# EAGLE design Main Board - Single v20  (EAGLE 9.7.0)
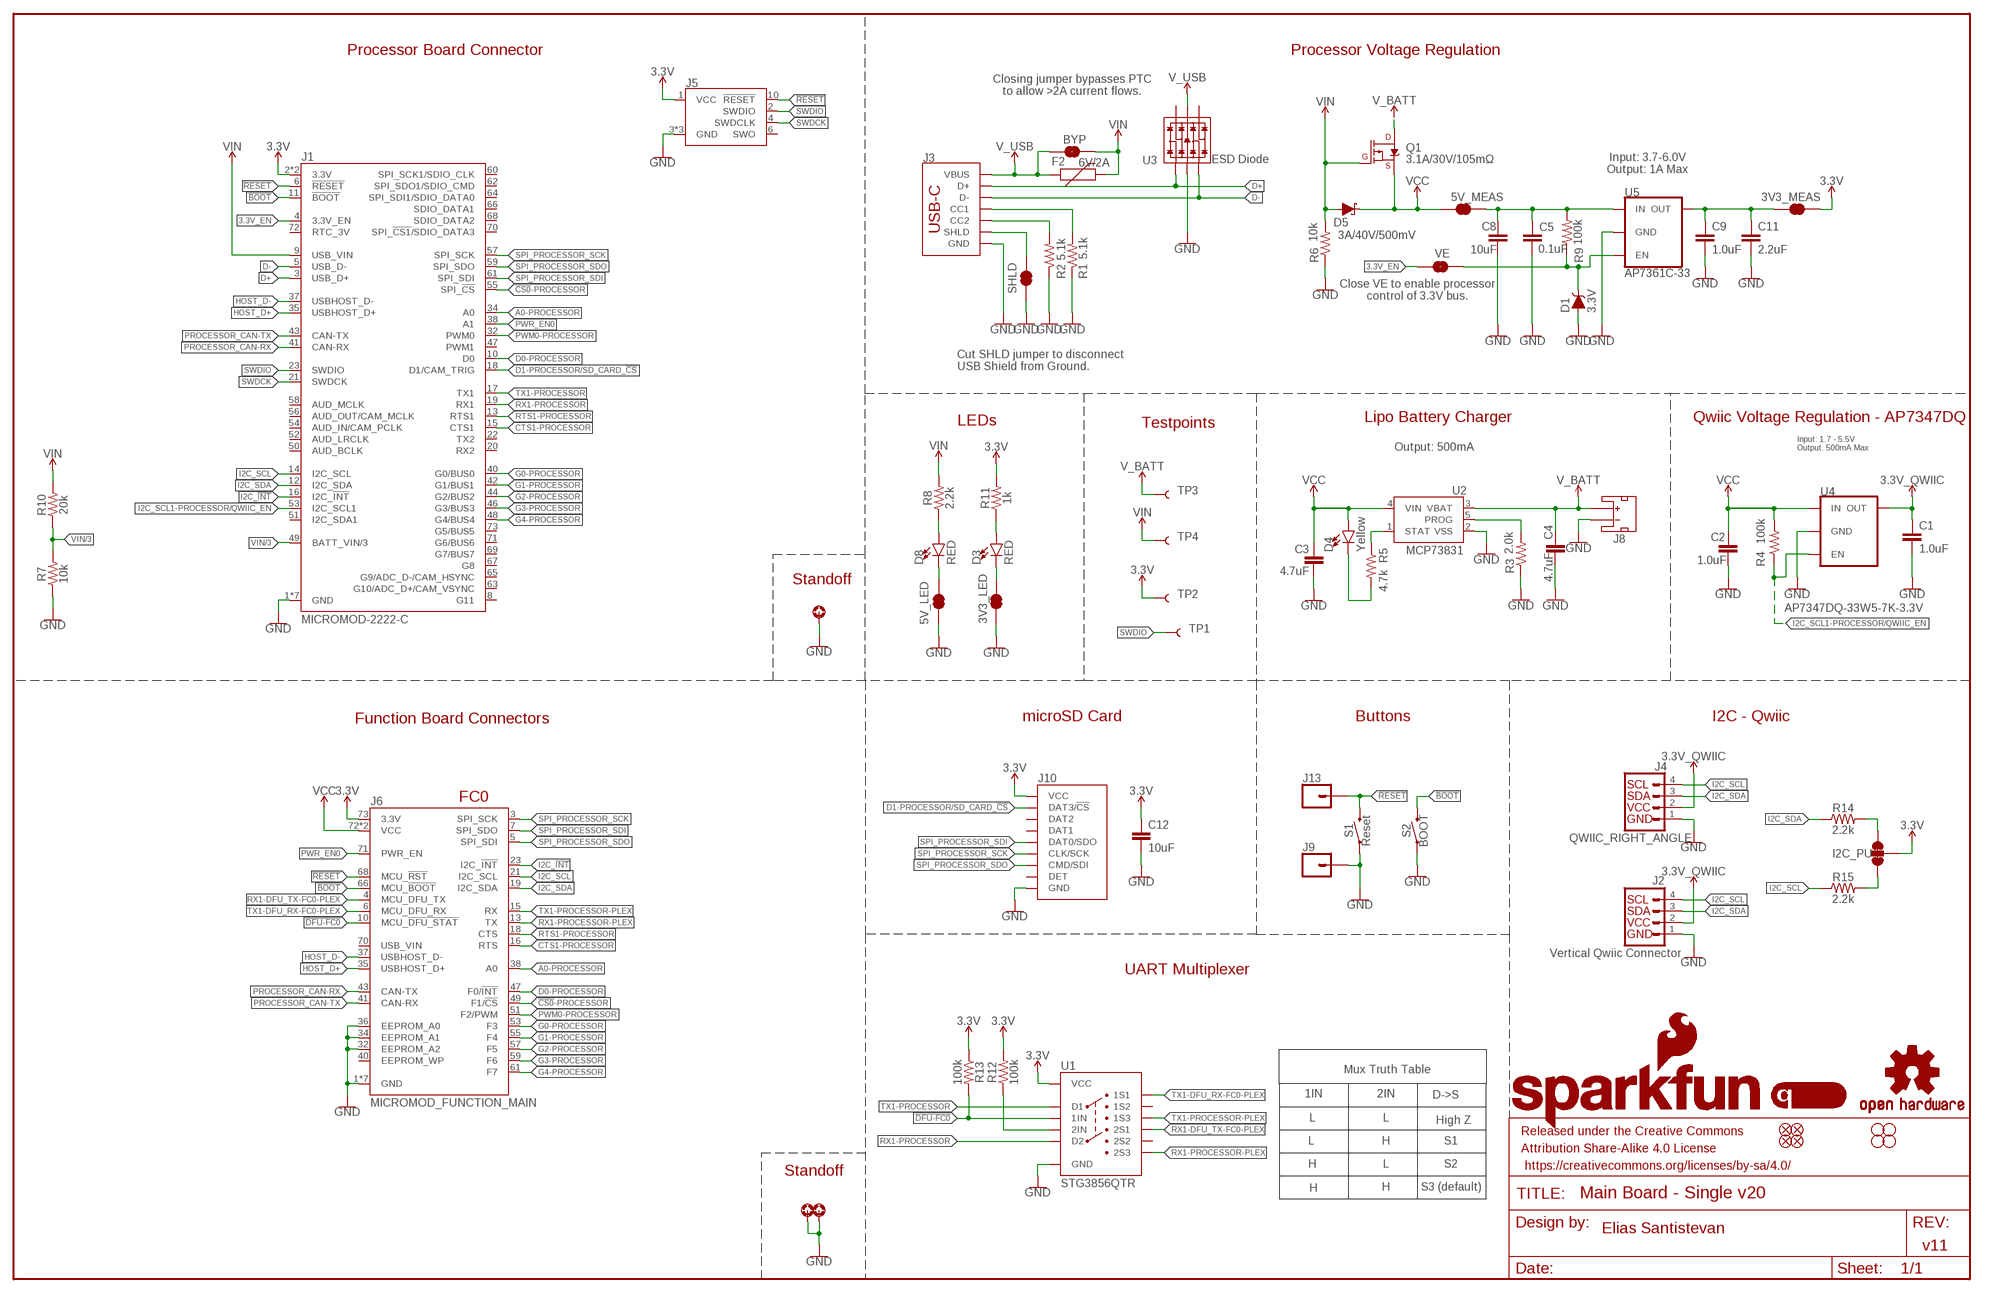
[diagram p0: schematic, sheet 1]

## Parts
3V3_LED  JUMPER-SMT_2_NC_TRACE_SILK  [SMT-JUMPER_2_NC_TRACE_SILK]
3V3_MEAS  JUMPER-COMBO_2_NC_TRACE  [COMBO-JUMPER_2_NC_TRACE]
5V_LED  JUMPER-SMT_2_NC_TRACE_SILK  [SMT-JUMPER_2_NC_TRACE_SILK]
5V_MEAS  JUMPER-COMBO_2_NC_TRACE  [COMBO-JUMPER_2_NC_TRACE]
BYP  JUMPER-SMT_2_NO_SILK  [SMT-JUMPER_2_NO_SILK]
C1  1.0uF  1.0UF-0603-16V-10%  [0603]
C2  1.0uF  1.0UF-0603-16V-10%  [0603]
C3  4.7uF  4.7UF-0603-6.3V-(10%)  [0603]
C4  4.7uF  4.7UF-0603-35V-(20%)  [0603]
C5  0.1uF  0.1UF-0603-25V-(+80/-20%)  [0603]
C8  10uF  10UF-0805-10V-10%  [0805]
C9  1.0uF  1.0UF-0603-16V-10%  [0603]
C11  2.2uF  2.2UF-0603-10V-20%  [0603]
C12  10uF  10UF-0603-6.3V-20%  [0603]
D1  3.3V  DIODE-ZENER-MM3Z3V3T1G  [SOD-323]
D3  RED  LED-RED0603  [LED-0603]
D4  Yellow  LED-YELLOW0603  [LED-0603]
D5  3A/40V/500mV  DIODE-SCHOTTKY-B340A  [SMA-DIODE]
D8  RED  LED-RED0603  [LED-0603]
F2  6V/2A  PPTC_6V2A  [1210]
FD1  FIDUCIAL1X2  [FIDUCIAL-1X2]
FD2  FIDUCIAL1X2  [FIDUCIAL-1X2]
FD3  FIDUCIAL1X2  [FIDUCIAL-1X2]
FD4  FIDUCIAL1X2  [FIDUCIAL-1X2]
FRAME1  FRAME-LEDGER  [CREATIVE_COMMONS]
H2  STAND-OFF-REFLOW-M2.5_2.5MM_TALL  [STAND-OFF-REFLOW-M2.5]
H4  STAND-OFF-REFLOW-M2.5_2.5MM_TALL  [STAND-OFF-REFLOW-M2.5]
H8  STAND-OFF-REFLOW-M2.5_2.5MM_TALL  [STAND-OFF-REFLOW-M2.5]
H14  STAND-OFFTIGHT  [STAND-OFF-TIGHT]
H15  STAND-OFFTIGHT  [STAND-OFF-TIGHT]
H16  STAND-OFFTIGHT  [STAND-OFF-TIGHT]
H17  STAND-OFFTIGHT  [STAND-OFF-TIGHT]
I2C_PU  JUMPER-SMT_3_2-NC_TRACE_SILK  [SMT-JUMPER_3_2-NC_TRACE_SILK]
J1  MICROMOD-2222-C  [M.2-CONNECTOR-E]
J2  Vertical Qwiic Connector  QWIIC_CONNECTOR  [JST04_1MM_VERT]
J3  USB_C_2-LAYER_PADS  [USB-C-16P-2LAYER-PADS]
J4  QWIIC_RIGHT_ANGLE  QWIIC_CONNECTORJS-1MM  [JST04_1MM_RA]
J5  CORTEX_JTAG_DEBUG_MINIMUM_PTH  [2X5-PTH-1.27MM]
J6  MICROMOD_FUNCTION_MAIN  [M.2-CONNECTOR-E-FUNCTION-STANDARD]
J8  JST_2MM_MALE  [JST-2-SMD]
J9  CONN_01PTH_NO_SILK_YES_STOP  [1X01_NO_SILK]
J10  MICRO-SD-PUSH-PUSH-EXT-PIN  [MICROSD-EXTERNALPIN]
J13  CONN_01PTH_NO_SILK_YES_STOP  [1X01_NO_SILK]
LOGO1  QWIIC_LOGO_8MM  [QWIIC_8MM]
LOGO2  SFE_LOGO_NAME_FLAME.3_INCH  [SFE_LOGO_NAME_FLAME_.3]
LOGO3  OSHW-LOGOL  [OSHW-LOGO-L]
Q1  3.1A/30V/105mΩ  MOSFET_PCH-DMG2307L  [SOT23-3]
R1  5.1k  5.1KOHM5.1KOHM-0603-1/10W-1%  [0603]
R2  5.1k  5.1KOHM5.1KOHM-0603-1/10W-1%  [0603]
R3  2.0k  2.0KOHM-0603-1/10W-5%  [0603]
R4  100k  100KOHM-0603-1/10W-1%  [0603]
R5  4.7k  4.7KOHM-0603-1/10W-1%  [0603]
R6  10k  10KOHM-0603-1/10W-1%  [0603]
R7  10k  10KOHM-0603-1/10W-1%  [0603]
R8  2.2k  2.2KOHM-0603-1/10W-1%  [0603]
R9  100k  100KOHM-0603-1/10W-1%  [0603]
R10  20k  20KOHM-0603-1/10W-1%  [0603]
R11  1k  1KOHM-0603-1/10W-1%  [0603]
R12  100k  100KOHM-0603-1/10W-1%  [0603]
R13  100k  100KOHM-0603-1/10W-1%  [0603]
R14  2.2k  2.2KOHM-0603-1/10W-1%  [0603]
R15  2.2k  2.2KOHM-0603-1/10W-1%  [0603]
S1  Reset  MOMENTARY-SWITCH-SPST-SMD-5.2-TALL-REDUNDANT  [TACTILE_SWITCH_SMD_5.2MM]
S2  BOOT  MOMENTARY-SWITCH-SPST-SMD-5.2-TALL-REDUNDANT  [TACTILE_SWITCH_SMD_5.2MM]
SHLD  JUMPER-SMT_2_NC_TRACE_SILK  [SMT-JUMPER_2_NC_TRACE_SILK]
TP1  TEST-POINT3X5  [PAD.03X.05]
TP2  TEST-POINT3X5  [PAD.03X.05]
TP3  TEST-POINT3X5  [PAD.03X.05]
TP4  TEST-POINT3X5  [PAD.03X.05]
U1  STG3856QTR  [STG3856]
U2  MCP73831  [SOT23-5]
U3  ESD Diode  TVS_DIODE_ARRAYSMD  [SOT-23-6]
U4  AP7347DQ-33W5-7K-3.3V  [SOT25]
U5  AP7361C-33  AP7361C-33FGEUDFN-8  [UDFN-8]
VE  JUMPER-SMT_2_NO_SILK  [SMT-JUMPER_2_NO_SILK]

## Nets
3.3V [POWER]: 3V3_MEAS.2 3V3_MEAS.4 C12.1 I2C_PU.2 J1.2(3.3V) J1.74(3.3V) J5.1(VCC) J6.73(3.3V) J10.4(VCC) R11.2 R12.2 R13.1 TP2.1 U1.P11(VCC)
3.3V_EN: J1.4(3.3V_EN) VE.1
3.3V_EN_VE: D1.C R9.1 U5.5(EN) VE.2
3.3V_QWIIC: C1.1 J2.2 J4.2 U4.5(OUT)
!BOOT!: J1.11(!BOOT!) J6.66(MCU_!BOOT!) S2.3 S2.4
!CS0!-PROCESSOR: J1.55(SPI_!CS!) J6.49(F1/!CS!)
!DFU-FC0!: J6.10(MCU_!DFU_STAT!) R13.2 U1.P12(1IN)
!DFU-FC1!: R12.1 U1.P10(2IN)
!RESET!: J1.6(!RESET!) J5.10(!RESET) J6.68(MCU_!RST!) J13.1 S1.3 S1.4
A0-PROCESSOR: J1.34(A0) J6.38(A0)
CTS1-PROCESSOR: J1.15(CTS1) J6.16(RTS)
D0-PROCESSOR: J1.10(D0) J6.47(F0/!INT!)
D1-PROCESSOR/SD_CARD_!CS!: J1.18(D1/CAM_TRIG) J10.2(DAT3/!CS!)
D+ [Diff pairs]: J1.3(USB_D+) J3.A6(D+) J3.B6(D+) U3.1(IO1)
D- [Diff pairs]: J1.5(USB_D-) J3.A7(D-) J3.B7(D-) U3.3(IO2)
G0-PROCESSOR: J1.40(G0/BUS0) J6.53(F3)
G1-PROCESSOR: J1.42(G1/BUS1) J6.55(F4)
G2-PROCESSOR: J1.44(G2/BUS2) J6.57(F5)
G3-PROCESSOR: J1.46(G3/BUS3) J6.59(F6)
G4-PROCESSOR: J1.48(G4/BUS4) J6.61(F7)
GND: 3V3_LED.1 5V_LED.1 C1.2 C2.2 C3.2 C4.2 C5.2 C8.2 C9.2 C11.2 C12.2 D1.A H2.1 H4.1 H8.1 J1.1(GND) J1.7(GND) J1.33(GND) J1.36(GND) J1.39(GND) J1.45(GND) J1.75(GND) J2.1 J3.GND J3.GND2(GND) J4.1 J5.3(GND) J5.5(GND) J5.9(GND) J6.1(GND) J6.2(GND) J6.8(GND) J6.32(EEPROM_A2) J6.33(GND) J6.34(EEPROM_A1) J6.36(EEPROM_A0) J6.39(GND) J6.45(GND) J6.75(GND) J8.1(-) J9.1 J10.6(GND) J10.10(GND) J10.11(GND) J10.12(GND) J10.13(GND) R1.1 R2.1 R3.1 R6.1 R7.1 S1.1 S1.2 S2.1 S2.2 SHLD.1 U1.P5(GND) U2.2(VSS) U3.2(VSS) U4.2(GND) U5.4(GND) U5.EP(GND)
HOST_D+ [Diff pairs]: J1.35(USBHOST_D+) J6.35(USBHOST_D+)
HOST_D- [Diff pairs]: J1.37(USBHOST_D-) J6.37(USBHOST_D-)
I2C_!INT!: J1.16(I2C_!INT!) J6.23(I2C_!INT!)
I2C_SCL: J1.14(I2C_SCL) J2.4 J4.4 J6.21(I2C_SCL) R15.1
I2C_SCL1-PROCESSOR/QWIIC_EN: J1.53(I2C_SCL1) R4.1 U4.3(EN)
I2C_SDA: J1.12(I2C_SDA) J2.3 J4.3 J6.19(I2C_SDA) R14.1
N$1: 3V3_MEAS.1 3V3_MEAS.3 C9.1 C11.1 U5.1(OUT)
N$2: 5V_LED.2 D8.C
N$3: D3.A R11.1
N$4: J3.B5(CC2) R2.2
N$5: J3.A5(CC1) R1.2
N$6: R3.2 U2.5(PROG)
N$10: 3V3_LED.2 D3.C
N$11: I2C_PU.3 R14.2
N$12: D8.A R8.1
N$13: I2C_PU.1 R15.2
N$14: D4.C R5.2
N$15: R5.1 U2.1(STAT)
PROCESSOR_CAN-RX: J1.41(CAN-RX) J6.43(CAN-TX)
PROCESSOR_CAN-TX: J1.43(CAN-TX) J6.41(CAN-RX)
PWM0-PROCESSOR: J1.32(PWM0) J6.51(F2/PWM)
PWR_EN0: J1.38(A1) J6.71(PWR_EN)
RTS1-PROCESSOR: J1.13(RTS1) J6.18(CTS)
RX1-DFU_TX-FC0-PLEX: J6.4(MCU_DFU_TX) U1.P9(2S1)
RX1-PROCESSOR: J1.19(RX1) U1.P6(D2)
RX1-PROCESSOR-PLEX: J6.13(TX) U1.P7(2S3)
SHLD: J3.SHLD1(SHLD) J3.SHLD2(SHLD) J3.SHLD3(SHLD) J3.SHLD4(SHLD) SHLD.2
SPI_PROCESSOR_SCK: J1.57(SPI_SCK) J6.3(SPI_SCK) J10.5(CLK/SCK)
SPI_PROCESSOR_SDI: J1.61(SPI_SDI) J6.7(SPI_SDO) J10.7(DAT0/SDO)
SPI_PROCESSOR_SDO: J1.59(SPI_SDO) J6.5(SPI_SDI) J10.3(CMD/SDI)
SWDCK: J1.21(SWDCK) J5.4(SWDCLK)
SWDIO: J1.23(SWDIO) J5.2(SWDIO) TP1.1
TX1-DFU_RX-FC0-PLEX: J6.6(MCU_DFU_RX) U1.P1(1S1)
TX1-PROCESSOR: J1.17(TX1) U1.P4(D1)
TX1-PROCESSOR-PLEX: J6.15(RX) U1.P3(1S3)
V_BATT [POWER]: C4.1 J8.2(+) Q1.3(D) TP3.1 U2.3(VBAT)
V_USB: BYP.1 F2.1 J3.VBUS1(VBUS) J3.VBUS2(VBUS) U3.5(VCC)
VCC: 5V_MEAS.1 5V_MEAS.3 C2.1 C3.1 D4.A D5.C J6.72(VCC) J6.74(VCC) Q1.2(S) R4.2 U2.4(VIN) U4.1(IN)
VCC_MEAS: 5V_MEAS.2 5V_MEAS.4 C5.1 C8.1 R9.2 U5.8(IN)
VIN: BYP.2 D5.A F2.2 J1.9(USB_VIN) Q1.1(G) R6.2 R8.2 R10.2 TP4.1
VIN/3: J1.49(BATT_VIN/3) R7.2 R10.1
Unconnected: J1.8(G11) J1.20(RX2) J1.22(TX2) J1.47(PWM1) J1.50(AUD_BCLK) J1.51(I2C_SDA1) J1.52(AUD_LRCLK) J1.54(AUD_IN/CAM_PCLK) J1.56(AUD_OUT/CAM_MCLK) J1.58(AUD_MCLK) J1.60(SPI_SCK1/SDIO_CLK) J1.62(SPI_SDO1/SDIO_CMD) J1.63(G10/ADC_D+/CAM_VSYNC) J1.64(SPI_SDI1/SDIO_DATA0) J1.65(G9/ADC_D-/CAM_HSYNC) J1.66(SDIO_DATA1) J1.67(G8) J1.68(SDIO_DATA2) J1.69(G7/BUS7) J1.70(SPI_!CS1!/SDIO_DATA3) J1.71(G6/BUS6) J1.72(RTC_3V) J1.73(G5/BUS5) J5.6(SWO) J6.40(EEPROM_WP) J6.70(USB_VIN) J8.NC1(PAD1) J8.NC2(PAD2) J10.1(DAT2) J10.8(DAT1) J10.9(DET) U1.P2(1S2) U1.P8(2S2) U3.4(IO3) U3.6(IO4)

## Notes on the sheet
- Processor Board Connector | Processor Voltage Regulation
- Closing jumper bypasses PTC
  to allow >2A current flows.
- Input: 3.7-6.0V
  Output: 1A Max
- Close VE to enable processor
  control of 3.3V bus.
- Cut SHLD jumper to disconnect
  USB Shield from Ground.
- Lipo Battery Charger | Qwiic Voltage Regulation - AP7347DQ
- LEDs | Testpoints
- Output: 500mA
- Input: 1.7 - 5.5V
  Output: 500mA Max
- Standoff
- Function Board Connectors | microSD Card | Buttons | I2C - Qwiic
- FC0
- UART Multiplexer
- Mux Truth Table
- 1IN | 2IN | D->S
- L | L | High Z
- L | H | S1
- H | L | S2
- Standoff
- H | H | S3 (default)
- Elias Santistevan
- v11

## Library data of the parts
3V3_LED 5V_LED SHLD = SparkFun-Jumpers:JUMPER-SMT_2_NC_TRACE: Normally closed trace jumper This jumper has a trace between two pads so it's normally closed (NC). Use a razor knife to open the connection. For best results follow the IPC guidelines for cutting traces: Cutout at least 0.063 mm (0.005 in). Remove all loose material to clean up the cut area. Seal the cut with an approved epoxy. Reapply solder to reclose the connection.
3V3_MEAS 5V_MEAS = SparkFun-Jumpers:JUMPER-COMBO_2_NC_TRACE
BYP VE = SparkFun-Jumpers:JUMPER-SMT_2_NO: Normally open jumper This jumper has two pads in close proximity to each other. Apply solder to close the connection. Round pads are easier to solder for beginners, but are a lot larger. SparkFun Product that uses the round pads: SparkFun EL Sequencer <https://www.sparkfun.com/products/12781>
C1 C2 C9 = SparkFun-Capacitors:1.0UF: 1µF ceramic capacitors A capacitor is a passive two-terminal electrical component used to store electrical energy temporarily in an electric field.; PROD_ID: CAP-00868
C3 = SparkFun-Capacitors:4.7UF: 4.7µF ceramic capacitors A capacitor is a passive two-terminal electrical component used to store electrical energy temporarily in an electric field.; PROD_ID: CAP-08280
C4 = SparkFun-Capacitors:4.7UF: 4.7µF ceramic capacitors A capacitor is a passive two-terminal electrical component used to store electrical energy temporarily in an electric field.; PROD_ID: CAP-14106
C5 = SparkFun-Capacitors:0.1UF: 0.1µF ceramic capacitors A capacitor is a passive two-terminal electrical component used to store electrical energy temporarily in an electric field.; PROD_ID: CAP-00810
C8 = SparkFun-Capacitors:10UF: 10.0µF ceramic capacitors A capacitor is a passive two-terminal electrical component used to store electrical energy temporarily in an electric field.; PROD_ID: CAP-11330
C11 = SparkFun-Capacitors:2.2UF: 2.2µF ceramic capacitors A capacitor is a passive two-terminal electrical component used to store electrical energy temporarily in an electric field.; PROD_ID: CAP-07888
C12 = SparkFun-Capacitors:10UF: 10.0µF ceramic capacitors A capacitor is a passive two-terminal electrical component used to store electrical energy temporarily in an electric field.; PROD_ID: CAP-11015
D1 = SparkFun-DiscreteSemi:DIODE-ZENER: Zener Diode A Zener diode allows current to flow from its anode to its cathode like a normal semiconductor diode, but it also permits current to flow in the reverse direction when its "Zener voltage" is reached. - WIkipedia; PROD_ID: DIO-11284
D3 D8 = SparkFun-LED:LED-RED: Red SMD LED Used in manufacturing of most products at SparkFun Packages: 0603 - SMD 0603 package [Product Link] <http://docs.avagotech.com/docs/AV02-0551EN> 0603 SMART - SMD 0603 SMART package ( more efficient and expensive)[Product Link] <http://www.osram-os.com/Graphics/XPic2/00077099_0.pdf> 1206 - SMD1206 package [Product Link] <https://www.sparkfun.com/datasheets/DevTools/LilyPad/Q150OVS4.pdff> SparkFun Products: Pro Mini 328 -5V <https://www.sparkfun.com/products/821> RedBoard <https://www.sparkfun.com/products/12757> IOIO-OTG <https://www.sparkfun.com/products/13613>; PROD_ID: DIO-00819
D4 = SparkFun-LED:LED-YELLOW: Yellow SMD LED Used in manufacturing several products at SparkFun. Packages: 0603 - SMD 0603 package[Product Link] <http://www.kingbrightusa.com/product.asp?catalog_name=LED&product_id=APT1608SYCK> 0603 -SMART - SMART SMD 0603 package (more efficient/more expensive) [Product Link] <http://www.osram-os.com/osram_os/en/products/product-catalog/led-light-emitting-diodes/smartled-0603/ly-l29k/index.jsp> LilyPad - SMD1206 package[Product Datasheet] <https://www.sparkfun.com/datasheets/DevTools/LilyPad/Q150YUS4.pdf> SparkFun Products: Blynk Board <https://www.sparkfun.com/products/13794> IOIO-OTG <https://www.sparkfun.com/products/13613> XBee Explorer Serial <https://www.sparkfun.com/products/13225>; PROD_ID: DIO-09003
D5 = SparkFun-DiscreteSemi:DIODE-SCHOTTKY: Schottky diode A Schottky diode is a semiconductor diode which has a low forward voltage drop and a very fast switching action.; PROD_ID: DIO-09886
F2 = SparkFun-Fuses:PPTC: Resettable Fuse PPTC Resettable Fuse. Really a sort of resistor with a polymeric positive temperature coefficient whose resistance increases dramatically with an increase in temperature. When heated by the power passing through the resistance rises causing the current to be limited, protecting the circuit. This is achieved by the transition of the polymer from a crystalline to an amorphous state where the conductive carbon separates breaking the conductive pathways found in the cool crystalline structure. When a PPTC cools back down it resumes conducting letting the circuit turn back on. SparkFun Products: SparkFun RedBoard - Programmed with Arduino <https://www.sparkfun.com/products/12757> Pro Micro - 5V/16MHz <https://www.sparkfun.com/products/12640> Arduino Pro 328 - 5V/16MHz <https://www.sparkfun.com/products/10915> MP3 Trigger <https://www.sparkfun.com/products/13720>; PROD_ID: RES-14313
FD1-FD4 = SparkFun-Aesthetics:FIDUCIAL: Fiducial Alignment Points Point-of-reference for pick-and-place machines and other optical instruments.
FRAME1 = SparkFun-Aesthetics:FRAME-LEDGER: Schematic Frame - Ledger Standard 11x14 US Ledger frame
H2 H4 H8 = SparkFun-Hardware:STAND-OFF-REFLOW: Stand Off Reflow Compatible A metal standoff that can be placed and reflowed onto a PCB. The M2.5 x 2.5mm variant is used on MicroMod. The M2.5 x 1.5mm variant is used to hold mPCIe boards, including the Swarm M138. The M2.0 x 6.0mm variant is used to mount the Iridium 9603N modem.; PROD_ID: HW-14899
H14-H17 = SparkFun-Hardware:STAND-OFF: Stand Off Drill holes for mechanically mounting via screws, standoffs, etc. Note: Use the keepout ring to avoid running the screw head into surrounding components. Variant Overviews STAND-OFF - Mechanical footprint for a #4 phillips button head screw. STAND-OFF-TIGHT - Mechanical footprint for a #4 phillips button head screw, Example SparkFun Products Screw - Phillips Head (1/4", 4-40, 10 pack) <https://www.sparkfun.com/products/10453> (PRT-10453) Screw - Phillips Head (1/2", 4-40, 10 pack) <https://www.sparkfun.com/products/10452> (PRT-10452) Screw - Phillips Head (3/4", 4-40, 10 pack) <https://www.sparkfun.com/products/10451> (PRT-10451) Screw - Phillips Head (1", 4-40, 10 pack) <https://www.sparkfun.com/products/10450> (PRT-10450)
I2C_PU = SparkFun-Jumpers:JUMPER-SMT_3_2-NC_TRACE: Normally closed trace jumper (2 of 2 connections) This jumper has a trace between all three pads so they are normally closed (NC). Use a razor knife to open the connection(s). For best results follow the IPC guidelines for cutting traces: Cutout at least 0.063 mm (0.005 in). Remove all loose material to clean up the cut area. Seal the cut with an approved epoxy. Reapply solder to reclose the connection(s).
J1 = SparkFun-MicroMod:MICROMOD: MicroMod Connector Description: A card edge connector and mating PCB connector to allow various MicroMod Processor Boards to be coupled with various carrier boards of different capabilities. Based on the M.2 standard.; PROD_ID: CONN-14877
J2 = SparkFun-Connectors:QWIIC_CONNECTOR: SparkFun I2C Standard Qwiic Connector An SMD 1mm pitch JST connector makes it easy and quick (get it? Qwiic?) to connect I2C devices to each other. The Qwiic system <http://www.sparkfun.com/qwiic> enables fast and solderless connection between popular platforms and various sensors and actuators. We carry 200mm <https://www.sparkfun.com/products/14204>, 100mm <https://www.sparkfun.com/products/14205>, 50mm <https://www.sparkfun.com/products/14206>, and breadboard friendly <https://www.sparkfun.com/products/14207> Qwiic cables. We also offer 10 pcs strips <https://www.sparkfun.com/products/14323> the SMD connectors.; PROD_ID: CONN-14483
J3 = SparkFun-Connectors:USB_C: USB Type C 16Pin Connector Super Speed pins not available on the 16-pin purely SMD connector so this part is best for USB 2.0 implementations. D1 and D2 are tied together enabling D+/- no matter which way the cable is plugged into the connector. The two channel configuration pins (CC1/2) are exposed. These are normally connected to ground via 5.1k resistors but can be reconfigured for high current/high power applications. **4-LAYER BOARD WARNING!!** If designing 4-layer board, make sure to select the variant _4-LAYER-ISOLATED. The linked footprint (USB-C-16-4LAYER-ISOLATED) includes some very necessary cutout polygons in the inner layers (2 and 15). This prevents the PTH mounting shield legs on the USB connector from electrically connecting any other polygons on the inner layers (usually VCC and GND).; PROD_ID: CONN-14122
J4 = SparkFun-Connectors:QWIIC_CONNECTOR: SparkFun I2C Standard Qwiic Connector An SMD 1mm pitch JST connector makes it easy and quick (get it? Qwiic?) to connect I2C devices to each other. The Qwiic system <http://www.sparkfun.com/qwiic> enables fast and solderless connection between popular platforms and various sensors and actuators. We carry 200mm <https://www.sparkfun.com/products/14204>, 100mm <https://www.sparkfun.com/products/14205>, 50mm <https://www.sparkfun.com/products/14206>, and breadboard friendly <https://www.sparkfun.com/products/14207> Qwiic cables. We also offer 10 pcs strips <https://www.sparkfun.com/products/14323> the SMD connectors.; PROD_ID: CONN-13694
J5 = SparkFun-Connectors:CORTEX_JTAG_DEBUG_MINIMUM: Cortex Debug Connector - 10 pin Supports JTAG debug, Serial Wire debug, and Serial Wire Viewer. PTH and SMD connector options available. General Connector Information <http://infocenter.arm.com/help/topic/com.arm.doc.faqs/attached/13634/cortex_debug_connectors.pdf> Products: PTH Connector <http://www.digikey.com/product-detail/en/cnc-tech/3220-10-0100-00/1175-1627-ND/3883661> -via Digi-Key SparkFun PSoc <https://www.sparkfun.com/products/13229> SparkFun T <https://www.sparkfun.com/products/13810>
J6 = SparkFun-MicroMod:MICROMOD_FUNCTION: MicroMod Connector Description: A card edge connector and mating PCB connector to allow various MicroMod Processor Boards to be coupled with various carrier boards of different capabilities. Based on the M.2 standard.; PROD_ID: CONN-14877
J8 = SparkFun-Connectors:JST_2MM_MALE: JST 2MM MALE RA CONNECTOR Two pin, compact surface mount connector. Commonly used as a battery input connection point. We really like the solid locking feeling and high current rating on these small connectors. We use these all the time as battery connectors. Mates to single-cell LiPo batteries. Here is the connector we sell at SparkFun: JST Right Angle Connector - White <https://www.sparkfun.com/products/8612> (PRT-08612) Datasheet <http://www.sparkfun.com/datasheets/Prototyping/Connectors/JST-Horizontal.pdf> It was used on these SparkFun products: SparkFun MOSFET Power Controller <https://www.sparkfun.com/products/11214> (PRT-11214) SparkFun Battery Babysitter - LiPo Battery Manager <https://www.sparkfun.com/products/13777> (PRT-13777) And many, many others that required a lipo battery connection.; PROD_ID: CONN-11443; SF_ID: PRT-08612
J9 J13 = SparkFun-Connectors:CONN_01: Single connection point. Often used as Generic Header-pin footprint for 0.1 inch spaced/style header connections On any of the 0.1 inch spaced packages, you can populate with these: Break Away Headers - Straight <https://www.sparkfun.com/products/116> (PRT-00116) Break Away Male Headers - Right Angle <https://www.sparkfun.com/products/553> (PRT-00553) Female Headers <https://www.sparkfun.com/products/115> (PRT-00115) Break Away Headers - Machine Pin <https://www.sparkfun.com/products/117> (PRT-00117) Break Away Female Headers - Swiss Machine Pin <https://www.sparkfun.com/products/743> (PRT-00743) This device is also useful as a general connection point to wire up your design to another part of your project. Our various solder wires solder well into these plated through hole pads. Hook-Up Wire - Assortment (Stranded, 22 AWG) <https://www.sparkfun.com/products/11375> (PRT-11375) Hook-Up Wire - Assortment (Solid Core, 22 AWG) <https://www.sparkfun.com/products/11367> (PRT-11367) View the entire wire category on our website here <https://www.sparkfun.com/categories/141> Special notes: SMTSO-256-ET is a "flush mount" nut for a 4-40 screw. We mostly use this on specialty testbeds; it is a nice way to connect hardware to your PCB at an adjustable hieght. Also note, the SNAP packages are for using a snappable style connector. We sell a baggie of snaps and they are also used on two LilyPad designs: Snap Assortment - 30 pack (male and female) <https://www.sparkfun.com/products/11347> (DEV-11347) LilyPad Arduino SimpleSnap <https://www.sparkfun.com/products/10941> (DEV-10941) LilyPad SimpleSnap Protoboard <https://www.sparkfun.com/products/10940> (DEV-10940)
J10 = SparkFun-Connectors:MICRO-SD: microSD Socket for Transflash Various sockets for µSD. tDoc lines correctly indicate media card edge positions when inserting (unlocked, locked, depressed). NOTE: CD1 and CD2 are connected internally, and the default detect state of the socket is detect pin to ground. SparkFun Products: WAV Trigger <https://www.sparkfun.com/products/13660> CAN-Bus Shield <https://www.sparkfun.com/products/13262> SparkFun Level Shifing microSD Breakout <https://www.sparkfun.com/products/13743>; PROD_ID: CONN-16110
LOGO1 = SparkFun-Aesthetics:QWIIC_LOGO: Qwiic Logos for placement on schematic and PCB. The 5.5mm silk logo is best for placing next to Qwiic connector.
LOGO2 = SparkFun-Aesthetics:SFE_LOGO_NAME_FLAME: SparkFun Font Logo w/ Flame This is the SparkFun full logo. The logo on the schematic will always be the same size; the package variant is the height of the flame part of the logo. Default layer for the logo on the board is tSilk.
LOGO3 = SparkFun-Aesthetics:OSHW-LOGO: Open-Source Hardware (OSHW) Logo This logo indicates the piece of hardware it is found on incorporates a OSHW license and/or adheres to the definition of open source hardware found here: http://freedomdefined.org/OSHW
Q1 = SparkFun-DiscreteSemi:MOSFET_PCH: P-channel MOSFETs Voltage controlled devices that allow control of high current outputs. SparkFun Products: SparkFun ESP32 Thing <https://www.sparkfun.com/products/13907> SparkFun ESP8266 Thing <https://www.sparkfun.com/products/13231> SparkFun Pi Servo HAT V2 <https://www.sparkfun.com/products/15316> DMG2305UX-7 (20V/4.2A/SOT23-3); PROD_ID: TRANS-11308
R1 R2 = SparkFun-Resistors:5.1KOHM; PROD_ID: RES-12083
R3 = SparkFun-Resistors:2.0KOHM: 2kΩ resistor A resistor is a passive two-terminal electrical component that implements electrical resistance as a circuit element. Resistors act to reduce current flow, and, at the same time, act to lower voltage levels within circuits. - Wikipedia; PROD_ID: RES-08296
R4 R9 R12 R13 = SparkFun-Resistors:100KOHM: 100kΩ resistor A resistor is a passive two-terminal electrical component that implements electrical resistance as a circuit element. Resistors act to reduce current flow, and, at the same time, act to lower voltage levels within circuits. - Wikipedia; PROD_ID: RES-07828
R5 = SparkFun-Resistors:4.7KOHM: 4.7kΩ resistor A resistor is a passive two-terminal electrical component that implements electrical resistance as a circuit element. Resistors act to reduce current flow, and, at the same time, act to lower voltage levels within circuits. - Wikipedia; PROD_ID: RES-07857
R6 R7 = SparkFun-Resistors:10KOHM: 10kΩ resistor A resistor is a passive two-terminal electrical component that implements electrical resistance as a circuit element. Resistors act to reduce current flow, and, at the same time, act to lower voltage levels within circuits. - Wikipedia; PROD_ID: RES-00824
R8 R14 R15 = SparkFun-Resistors:2.2KOHM: 2.2kΩ resistor A resistor is a passive two-terminal electrical component that implements electrical resistance as a circuit element. Resistors act to reduce current flow, and, at the same time, act to lower voltage levels within circuits. - Wikipedia; PROD_ID: RES-08272
R10 = SparkFun-Resistors:20KOHM: 20kΩ resistor A resistor is a passive two-terminal electrical component that implements electrical resistance as a circuit element. Resistors act to reduce current flow, and, at the same time, act to lower voltage levels within circuits. - Wikipedia; PROD_ID: RES-09383
R11 = SparkFun-Resistors:1KOHM: 1kΩ resistor A resistor is a passive two-terminal electrical component that implements electrical resistance as a circuit element. Resistors act to reduce current flow, and, at the same time, act to lower voltage levels within circuits. - Wikipedia; PROD_ID: RES-07856
S1 S2 = SparkFun-Switches:MOMENTARY-SWITCH-SPST: Momentary Switch (Pushbutton) - SPST Normally-open (NO) SPST momentary switches (buttons, pushbuttons). Variants PTH-12MM - 12mm square, through-hole Momentary Pushbutton Switch - 12mm Square <https://www.sparkfun.com/products/9190> (COM-09190) PTH-6.0MM, PTH-6.0MM-KIT - 6.0mm square, through-hole Mini Pushbutton Switch <https://www.sparkfun.com/products/97> (COM-00097) KIT package intended for soldering kit's - only one side of pads' copper is exposed. PTH-RIGHT-ANGLE-KIT - Right-angle, through-hole Right Angle Tactile Button <https://www.sparkfun.com/products/10791> - Used on SparkFun BigTime Watch Kit <https://www.sparkfun.com/products/11734> SMD-12MM - 12mm square, surface-mount Tactile Button - SMD (12mm) <https://www.sparkfun.com/products/12993> (COM-12993) Used on SparkFun PicoBoard <https://www.sparkfun.com/products/11888> SMD-4.5MM - 4.5mm Square Trackball Switch Used on SparkFun Blackberry Trackballer Breakout <https://www.sparkfun.com/products/13169> SMD-4.6MMX2.8MM - 4.60mm x 2.80mm, surface mount Used on SparkFun Pro Micro - RP2040 <https://www.sparkfun.com/products/17717> SMD-5.2MM, SMD-5.2-REDUNDANT - 5.2mm square, surface-mount Mini Pushbutton Switch - SMD <https://www.sparkfun.com/products/8720> (COM-08720) Used on Arduino Pro Mini <https://www.sparkfun.com/products/11114> REDUNDANT package connects both switch circuits together SMD-6.0X3.5MM - 6.0 x 3.5mm, surface mount Momentary Reset Switch SMD <https://www.sparkfun.com/products/8229> (COM-08229) SMD-6.2MM-TALL - 6.2mm square, surface mount Tactile Button - SMD (6mm) <https://www.sparkfun.com/products/12992> Used on SparkFun Digital Sandbox <https://www.sparkfun.com/products/12651> SMD-RIGHT-ANGLE - Right-angle, surface mount Used on SparkFun Block for Intel® Edison - Arduino <https://www.sparkfun.com/products/13036>; PROD_ID: SWCH-14139
TP1-TP4 = SparkFun-Connectors:TEST-POINT: SparkFun Test Points Bare copper test points for troubleshooting or In-Circuit-Testing. These are used by our Production team for verifying production board runs using pogo-pins on test beds. SparkFun Products: SparkFun LSM9DS1 Breakout <https://www.sparkfun.com/products/13284> SparkFun PSOC <https://www.sparkfun.com/products/13714> SparkFun Load Cell Amplifier <https://www.sparkfun.com/products/13879>
U1 = dip_switch:STG3856QTR
U2 = SparkFun-IC-Power:MCP73831: MCP73831T Li-Ion, Li-Pol Controller Miniature single cell, fully integrated Li-Ion, Li-polymer charge management controller Datasheet <http://ww1.microchip.com/downloads/en/DeviceDoc/20001984g.pdf> SparkFun Products: SparkFun ESP32 Thing <https://www.sparkfun.com/products/13907> SparkFun 9DoF Razor IMU M0 <https://www.sparkfun.com/products/14001>; PROD_ID: IC-09995
U3 = SparkFun-DiscreteSemi:TVS_DIODE_ARRAY; PROD_ID: IC-13538
U4 = dip_switch:AP7347DQ-33W5-7: AP7347DQ - 500mA CMOS LDO Regulator w/ Enable The AP2112 is CMOS process low dropout linear regulator with enable function, the regulator delivers a guaranteed 600mA (min.) continuous load current. Features Output Voltage Accuracy: ±1% Output Current: 500mA Foldback Short Current Protection: 180mA Enable Function to Turn ON/OFF VOUT Low Dropout Voltage (3.3V): 270mV (Typ.) @IOUT=500mA Excellent Load Regulation: 22.5mV Excellent Line Regulation: 0.02%/V (Typ.) Low Quiescent Current: 60μA (Typ.) Low Standby Current: 0.01μA (Typ.) Low Output Noise: 60μVRMS PSRR: 100Hz -65dB, 1kHz -65dB OTSD Protection Stable with 1.0μF Flexible Cap: Ceramic, Tantalum and Aluminum Electrolytic Operation Temperature Range: -40°C to 85°C ESD: MM 400V, HBM 4000V
U5 = SparkFun-IC-Power:AP7361C-33FGE: AP7361C 3.3V LDO Regulator; PROD_ID: VREG-14094

## Net classes
0 default: width 0.178 mm, drill 0.305 mm
1 POWER: width 0.559 mm, drill 0.305 mm
2 Diff pairs: width 0.203 mm, drill 0.305 mm

## Board
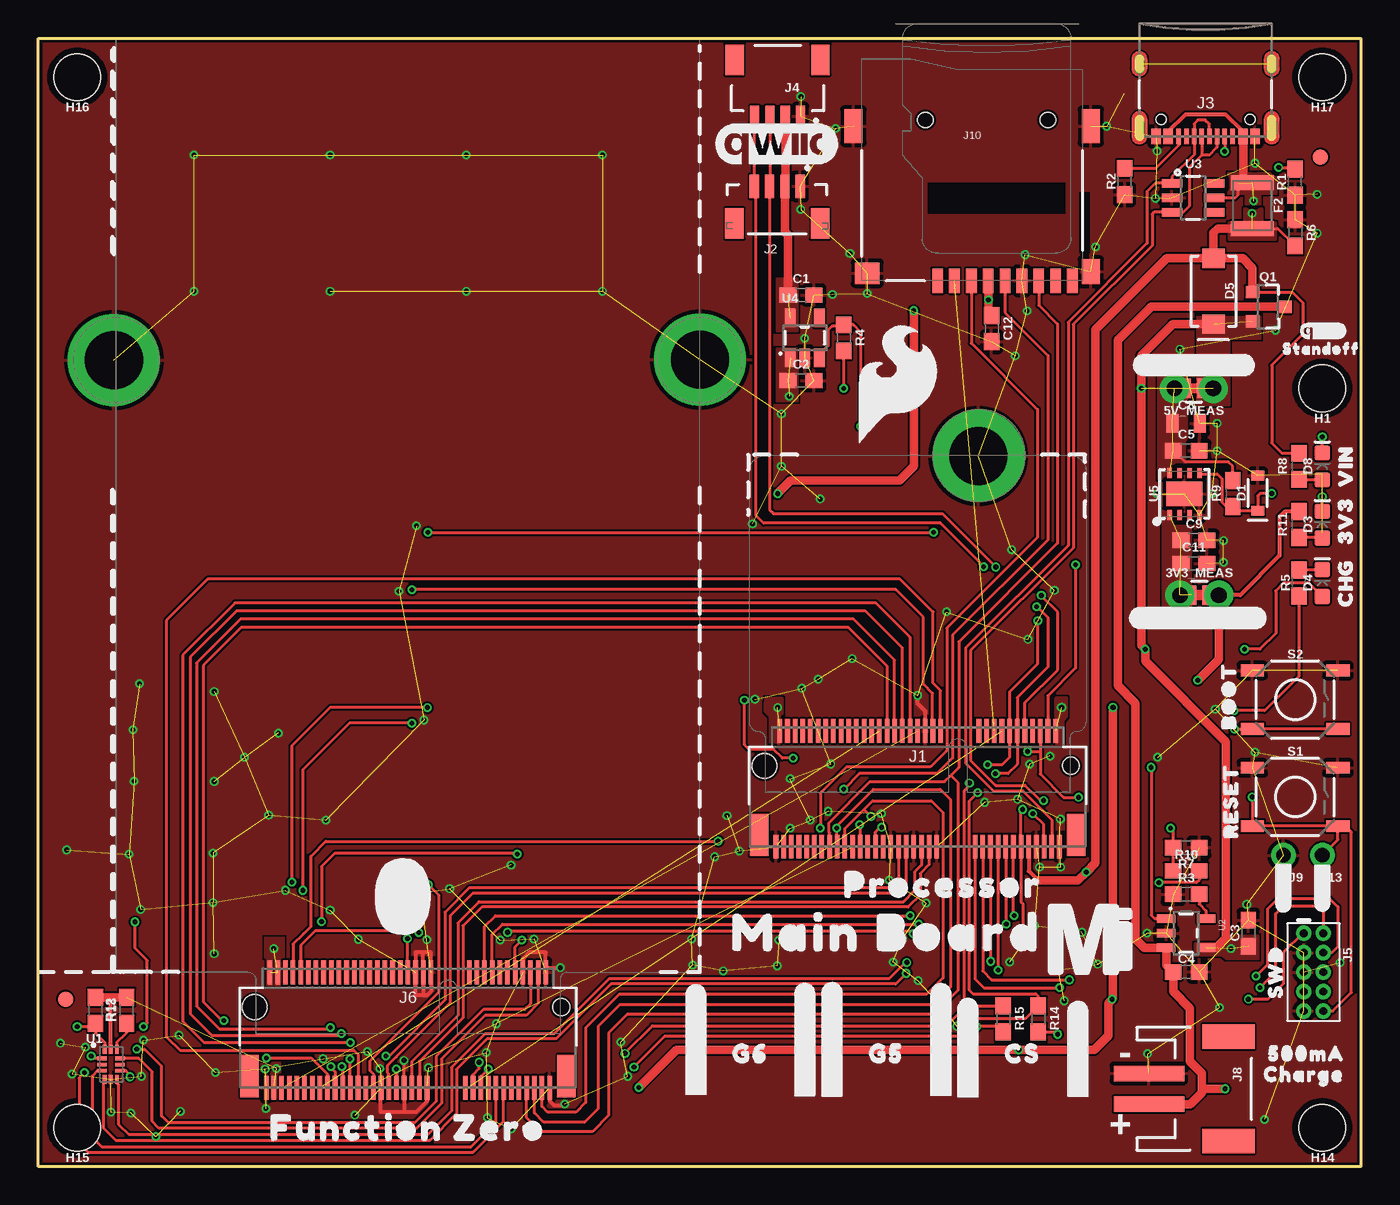
[diagram p1: board, top side]
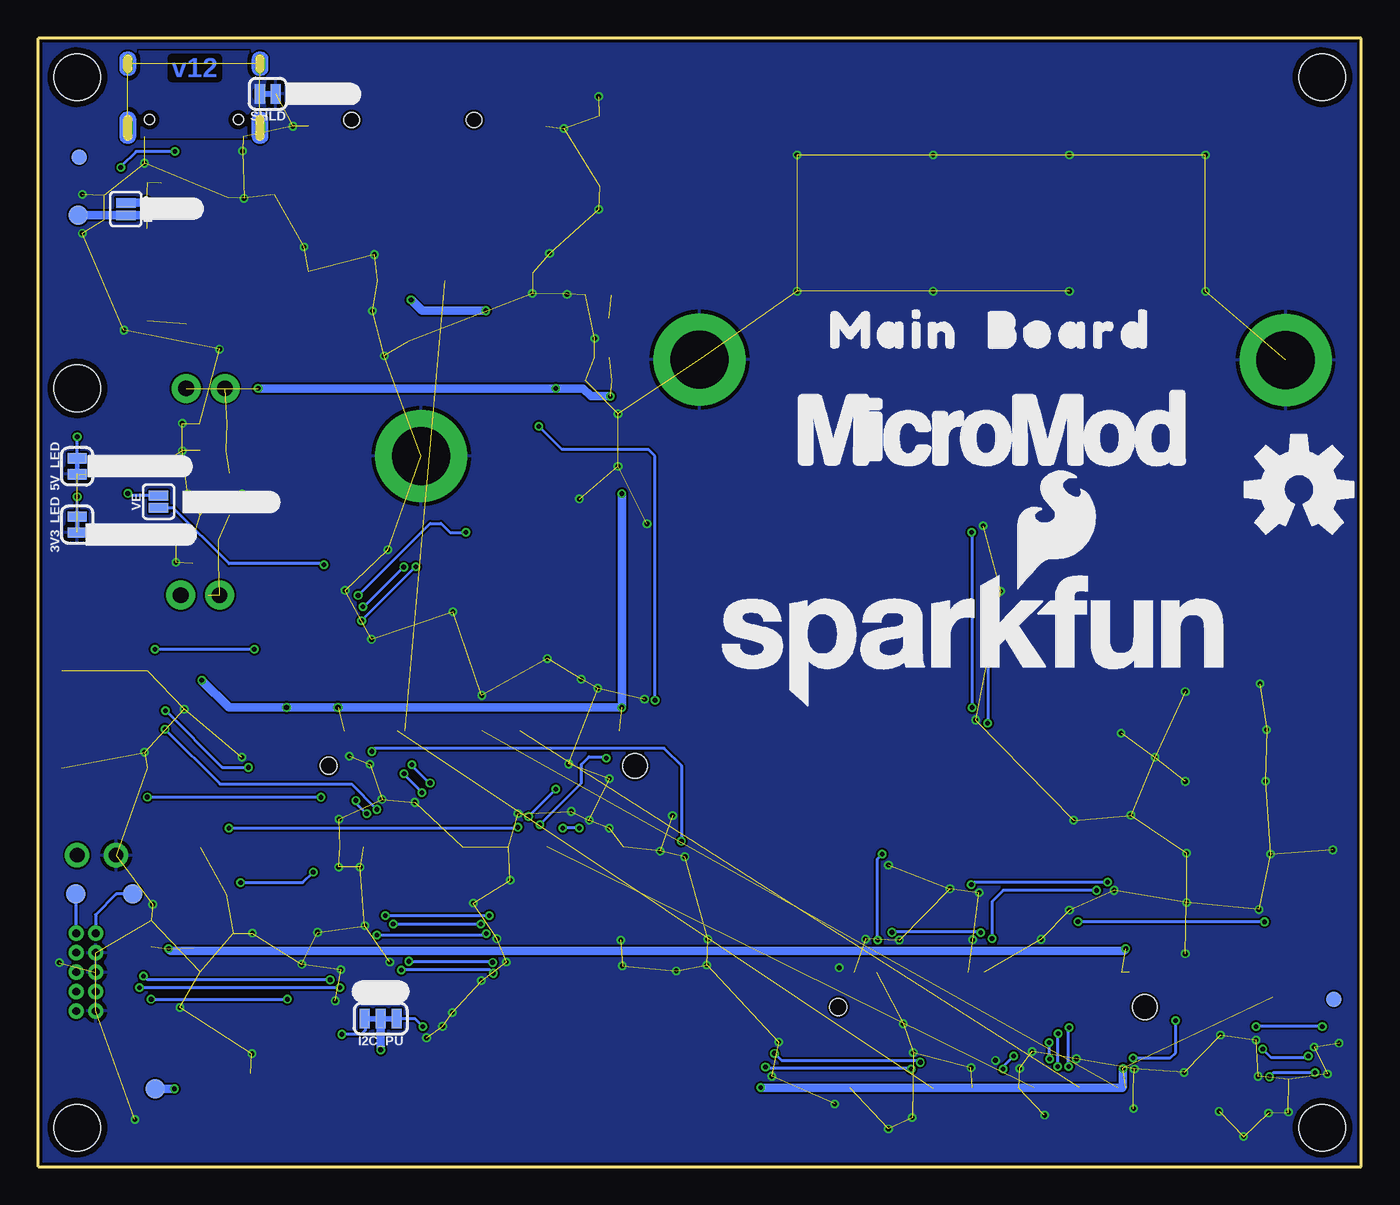
[diagram p2: board, bottom side, seen from below]

Size 86.36 x 73.66 mm. Coordinates in mm from the lower left corner, seen from the top.
Outline: 0,73.66 86.36,73.66 86.36,0 0,0 0,73.66
Copper layers (1*16): Top / Bottom
Stack-up Default Layer Stack: Top User Defined 0.035mm / Dielectric-1 User Defined 1.5mm / Bottom User Defined 0.035mm
Design rules "SparkFun-2-Layer-Minimum-JLCPCB": minimum track width 5mil, minimum drill 0.3mm, track to track 5mil, track to pad 5mil, pad to pad 5mil, via to via 5mil, smd to smd 5mil, copper to edge 7mil, drill to drill 7mil, minimum pad ring 5mil, minimum via ring 5mil, stop-mask expansion 2.5mil, vias tented up to drill 25mil, thermal gap 10mil
tRestrict: area 24.8,12.5 to 24.9,12.9; area 25.3,12.5 to 25.5,12.9

### Footprints (pad centres in the part's own frame; a part is rotated, then mirrored left to right if it is on the bottom)
SMT-JUMPER_2_NC_TRACE_SILK = smd 0.66 x 1.27: 1 -0.521,0; 2 0.521,0
COMBO-JUMPER_2_NC_TRACE = smd 0.635 x 1.27: 1 -0.508,0; 2 0.508,0 | drill 1.016 pad 1.88: 3 -1.27,0; 4 1.27,0
SMT-JUMPER_2_NO_SILK = smd 0.635 x 1.27: 1 -0.406,0; 2 0.406,0
0603 = smd 1.1 x 1: 1 -0.85,0; 2 0.85,0
0805 = smd 0.8 x 1.2: 1 -0.9,0; 2 0.9,0
SOD-323 = smd 0.63 x 0.83: A 1.15,0; C -1.15,0
LED-0603 = smd 1 x 1: A -0.877,0; C 0.877,0
SMA-DIODE = smd 1.27 x 1.47: A -2.15,0; C 2.15,0
1210 = smd 1 x 2.8: 1 -1.5,0; 2 1.5,0
FIDUCIAL-1X2 = smd 1 x 1: 1 0,0
STAND-OFF-TIGHT = hole 3.048: 0,0
STAND-OFF-REFLOW-M2.5 = drill 3.8 pad 6: 1 0,0
SMT-JUMPER_3_2-NC_TRACE_SILK = smd 0.66 x 1.27: 1 -1.041,0; 2 0,0; 3 1.041,0
M.2-CONNECTOR-E = smd 0.3 x 1.55: 1 9.25,-5.275; 2 9,2.275; 3 8.75,-5.275; 4 8.5,2.275; 5 8.25,-5.275; 6 8,2.275; 7 7.75,-5.275; 8 7.5,2.275; 9 7.25,-5.275; 10 7,2.275; 11 6.75,-5.275; 12 6.5,2.275; 13 6.25,-5.275; 14 6,2.275; 15 5.75,-5.275; 16 5.5,2.275; 17 5.25,-5.275; 18 5,2.275; 19 4.75,-5.275; 20 4.5,2.275; 21 4.25,-5.275; 22 4,2.275; 23 3.75,-5.275; 32 1.5,2.275; 33 1.25,-5.275; 34 1,2.275; 35 0.75,-5.275; 36 0.5,2.275; 37 0.25,-5.275; 38 0,2.275; 39 -0.25,-5.275; 40 -0.5,2.275; 41 -0.75,-5.275; 42 -1,2.275; 43 -1.25,-5.275; 44 -1.5,2.275; 45 -1.75,-5.275; 46 -2,2.275; 47 -2.25,-5.275; 48 -2.5,2.275; 49 -2.75,-5.275; 50 -3,2.275; 51 -3.25,-5.275; 52 -3.5,2.275; 53 -3.75,-5.275; 54 -4,2.275; 55 -4.25,-5.275; 56 -4.5,2.275; 57 -4.75,-5.275; 58 -5,2.275; 59 -5.25,-5.275; 60 -5.5,2.275; 61 -5.75,-5.275; 62 -6,2.275; 63 -6.25,-5.275; 64 -6.5,2.275; 65 -6.75,-5.275; 66 -7,2.275; 67 -7.25,-5.275; 68 -7.5,2.275; 69 -7.75,-5.275; 70 -8,2.275; 71 -8.25,-5.275; 72 -8.5,2.275; 73 -8.75,-5.275; 74 -9,2.275; 75 -9.25,-5.275 | smd 1.2 x 2.75: A1 10.35,-4.5; A2 -10.35,-4.5 | hole 1.1: 10,0 | hole 1.6: -10,0
JST04_1MM_VERT = smd 0.6 x 1.55: 1 -1.478,0.775; 2 -0.478,0.775; 3 0.522,0.775; 4 1.522,0.775 | smd 1.2 x 2: NC1 -2.778,3.2; NC2 2.822,3.2
USB-C-16P-2LAYER-PADS = smd 0.3 x 1: A5 -1.25,-0.34; A6 -0.25,-0.34; A7 0.25,-0.34; A8 1.25,-0.34; B5 1.75,-0.34; B6 0.75,-0.34; B7 -0.75,-0.34; B8 -1.75,-0.34 | smd 0.6 x 1: GND -3.225,-0.34; GND2 3.225,-0.34; VBUS1 -2.45,-0.34; VBUS2 2.45,-0.34 | drill 0.4 pad 0.6 long: SHLD1 -4.318,-0.915; SHLD2 4.318,-0.915; SHLD3 -4.318,-5.095; SHLD4 4.318,-5.095 | hole 0.65: -2.89,-1.445; 2.89,-1.445
JST04_1MM_RA = smd 0.6 x 1.35: 1 -1.5,0; 2 -0.5,0; 3 0.5,0; 4 1.5,0 | smd 1.2 x 2: NC1 2.8,-3.675; NC2 -2.8,-3.675
2X5-PTH-1.27MM = drill 0.508 pad 1: 1 -2.54,-0.635; 2 -2.54,0.635; 3 -1.27,-0.635; 4 -1.27,0.635; 5 0,-0.635; 6 0,0.635; 7 1.27,-0.635; 8 1.27,0.635; 9 2.54,-0.635; 10 2.54,0.635
M.2-CONNECTOR-E-FUNCTION-STANDARD = smd 0.3 x 1.55: 1 9.25,-5.275; 2 9,2.275; 3 8.75,-5.275; 4 8.5,2.275; 5 8.25,-5.275; 6 8,2.275; 7 7.75,-5.275; 8 7.5,2.275; 9 7.25,-5.275; 10 7,2.275; 11 6.75,-5.275; 12 6.5,2.275; 13 6.25,-5.275; 14 6,2.275; 15 5.75,-5.275; 16 5.5,2.275; 17 5.25,-5.275; 18 5,2.275; 19 4.75,-5.275; 20 4.5,2.275; 21 4.25,-5.275; 22 4,2.275; 23 3.75,-5.275; 32 1.5,2.275; 33 1.25,-5.275; 34 1,2.275; 35 0.75,-5.275; 36 0.5,2.275; 37 0.25,-5.275; 38 0,2.275; 39 -0.25,-5.275; 40 -0.5,2.275; 41 -0.75,-5.275; 42 -1,2.275; 43 -1.25,-5.275; 44 -1.5,2.275; 45 -1.75,-5.275; 46 -2,2.275; 47 -2.25,-5.275; 48 -2.5,2.275; 49 -2.75,-5.275; 50 -3,2.275; 51 -3.25,-5.275; 52 -3.5,2.275; 53 -3.75,-5.275; 54 -4,2.275; 55 -4.25,-5.275; 56 -4.5,2.275; 57 -4.75,-5.275; 58 -5,2.275; 59 -5.25,-5.275; 60 -5.5,2.275; 61 -5.75,-5.275; 62 -6,2.275; 63 -6.25,-5.275; 64 -6.5,2.275; 65 -6.75,-5.275; 66 -7,2.275; 67 -7.25,-5.275; 68 -7.5,2.275; 69 -7.75,-5.275; 70 -8,2.275; 71 -8.25,-5.275; 72 -8.5,2.275; 73 -8.75,-5.275; 74 -9,2.275; 75 -9.25,-5.275 | smd 1.2 x 2.75: A1 10.35,-4.5; A2 -10.35,-4.5 | hole 1.1: 10,0 | hole 1.6: -10,0
JST-2-SMD = smd 1 x 4.6: 1 -1,-3.7; 2 1,-3.7 | smd 1.6 x 3.4: NC1 -3.4,1.5; NC2 3.4,1.5
1X01_NO_SILK = drill 0.95 pad 1.6: 1 0,0
MICROSD-EXTERNALPIN = smd 0.7 x 1.6: 1 2.25,10.5; 2 1.15,10.5; 3 0.05,10.5; 4 -1.05,10.5; 5 -2.15,10.5; 6 -3.25,10.5; 7 -4.35,10.5; 8 -5.45,10.5; 9 -6.55,10.5 | smd 1.2 x 1.6: 10 -7.75,9.9 | smd 1.2 x 2.2: 11 -7.75,0.4; 12 7.75,0.4 | smd 1.6 x 1.4: 13 6.85,10 | hole 1: 3.05,0; -4.95,0
SOT23-3 = smd 0.8 x 0.9: 1 -0.95,-1; 2 0.95,-1; 3 0,1.1
TACTILE_SWITCH_SMD_5.2MM = smd 1.524 x 0.762: 1 -2.794,1.905; 2 2.794,1.905; 3 -2.794,-1.905; 4 2.794,-1.905
PAD.03X.05 = smd 1.27 x 1.27: 1 0,0
STG3856 = smd 0.6 x 0.25: P1 -0.59,0.41; P2 -0.59,0.01; P3 -0.59,-0.39; P7 0.58,-0.39; P8 0.58,0.01; P9 0.58,0.41 | smd 0.25 x 0.6: P4 -0.42,-0.96; P5 -0.02,-0.96; P6 0.38,-0.96; P10 0.38,1.01; P11 -0.02,1.01; P12 -0.42,1.01
SOT23-5 = smd 0.55 x 1.2: 1 -0.95,-1.3; 2 0,-1.3; 3 0.95,-1.3; 4 0.95,1.3; 5 -0.95,1.3
SOT-23-6 = smd 0.55 x 1.35: 1 -0.95,-1.375; 2 0,-1.375; 3 0.95,-1.375; 4 0.95,1.375; 5 0,1.375; 6 -0.95,1.375
SOT25 = smd 0.7 x 1.2: 1 -0.95,-1.3; 2 0,-1.3; 3 0.95,-1.3; 4 0.95,1.3; 5 -0.95,1.3
UDFN-8 = smd 0.3 x 0.65: 1 -0.975,-1.375; 2 -0.325,-1.375; 3 0.325,-1.375; 4 0.975,-1.375; 5 0.975,1.375; 6 0.325,1.375; 7 -0.325,1.375; 8 -0.975,1.375 | smd 2.35 x 1.6: EP 0,0

### Placement (x,y rotation side)
3V3_LED  83.82,41.91 90 bottom
3V3_MEAS  75.79,37.31 0 top
5V_LED  83.82,45.72 90 bottom
5V_MEAS  75.44,50.8 180 top
BYP  80.64,62.51 270 bottom
C1  49.78,56.9 0 top
C2  49.78,51.31 0 top
C3  78.99,15.24 90 top
C4  74.93,12.7 0 top
C5  74.93,46.74 0 top
C8  74.93,48.51 0 top
C9  75.44,40.89 0 top
C11  75.44,39.37 0 top
C12  62.23,54.71 270 top
D1  79.6,43.97 90 top
D3  83.82,41.91 90 top
D4  83.82,38.1 90 top
D5  76.71,57.15 270 top
D8  83.82,45.72 90 top
F2  79.25,62.74 270 top
FD1  1.78,10.92 180 bottom
FD2  1.78,10.92 180 top
FD3  83.69,65.91 270 top
FD4  83.69,65.91 90 bottom
FRAME1  16.51,-25.4 0 top  (outside the outline)
FRAME2  FRAME-LEDGERNO_FOOTPRINT  [DUMMY]  16.51,-25.4 0 top  (outside the outline)
H1  STAND-OFFTIGHT  [STAND-OFF-TIGHT]  83.82,50.8 180 top
H2  4.94,52.65 180 top
H4  43.19,52.68 90 top
H8  61.36,46.39 90 top
H14  83.82,2.54 180 top
H15  2.54,2.54 180 top
H16  2.54,71.12 180 top
H17  83.82,71.12 180 top
I2C_PU  64.01,9.65 180 bottom
J1  57.4,26.16 0 top
J2  48.26,64.77 180 top
J3  76.2,66.9 180 top
J4  48.26,68.58 180 top
J5  83.25,12.69 270 top
J6  24.13,10.41 0 top
J8  76.2,5.08 270 top
J9  81.28,20.32 180 top
J10  60.96,68.33 180 top
J13  83.82,20.32 180 top
LOGO1  48.21,66.75 0 top
LOGO2  25.4,34.29 0 bottom
LOGO3  4.06,44.2 0 bottom
Q1  80.26,56.13 270 top
R1  82.04,64.26 90 top
R2  70.92,64.31 90 top
R3  74.93,17.78 0 top
R4  52.58,54.1 270 top
R5  82.3,38.1 90 top
R6  82.04,60.96 270 top
R7  74.93,20.83 180 top
R8  82.3,45.72 90 top
R9  77.98,43.94 90 top
R10  74.93,19.3 0 top
R11  82.3,41.91 90 top
R12  5.77,10.21 90 top
R13  3.73,10.21 270 top
R14  65.28,9.65 270 top
R15  62.99,9.65 270 top
S1  82.04,24.13 0 top
S2  82.04,30.48 0 top
SHLD  71.37,70.03 180 bottom
TP1  83.92,17.8 180 bottom
TP2  80.19,17.79 0 bottom
TP3  78.74,5.08 90 bottom
TP4  83.74,62.13 180 bottom
U1  4.75,6.65 0 top
U2  74.93,15.24 270 top
U3  75.39,63.25 270 top
U4  50.04,54.1 0 top
U5  74.83,43.92 0 top
U$1  [#3V3_EN#502]  73.91,43.38 180 bottom
U$2  [#3V3_LED#502]  79.81,41.25 180 bottom
U$3  [#PTC#503]  77.77,62.53 180 bottom
U$4  [3V332533]  85.34,42.16 90 top
U$5  [VIN32532]  85.34,45.72 90 top
U$6  [CHG32531]  85.34,38.1 90 top
U$7  [#SHLD#501]  67.87,70.03 180 bottom
U$8  [BOOT32541]  77.72,30.73 90 top
U$9  [RESET32540]  77.85,23.88 90 top
U$10  [PROCESSOR525]  59.05,18.41 0 top
U$11  [FUNCTION_ZERO520]  24.13,2.54 0 top
U$13  [MAIN523]  30.48,54.61 0 bottom
U$14  [MICROMOD_MI_LOGO_1]  68.71,14.86 0 top
U$15  [0523]  24.13,17.53 0 top
U$17  [MICROMOD_LOGO_1]  24.13,48.26 0 bottom
U$18  [BOARD524]  19.05,54.61 0 bottom
U$19  [G518]  55.37,7.37 0 top
U$20  [#CS_ALT#20]  60.68,7.59 90 top
U$21  [MAIN_BOARD5523]  55.37,15.27 0 top
U$22  [QWIIC_3MM]  83.87,54.56 0 top
U$23  [STANDOFF501]  83.74,53.39 0 top
U$24  [SFE_LOGO_FLAME_.3]  56.13,51.05 0 top
U$25  [SWD6522]  80.77,12.7 90 top
U$26  [#3V3_MEAS#6522]  75.69,35.81 0 top
U$27  [CHARGE501]  82.63,6.02 0 top
U$28  [#VIN_LED#502]  79.88,45.72 180 bottom
U$29  [G6519]  46.48,7.37 0 top
U$30  [#I2C#501]  64.01,11.43 0 bottom
U$31  [#5V_MEAS#6522]  75.44,52.32 0 top
U$32  [CS17]  64.26,7.37 0 top
U$33  [500MA6520]  82.8,7.37 0 top
U$34  [#CS_DEF#19]  67.87,7.52 90 top
U$35  [#G5_PROC#21]  58.93,8.13 90 top
U$36  [#G6_PROC#21]  50.04,8.13 90 top
U$37  [#EN0_ALT#21]  51.82,8.13 90 top
U$38  [#EN1_ALT#21]  42.93,8.13 90 top
U$39  [#RST#6521]  83.82,18.29 90 top
U$40  [#GND#6520]  81.28,18.29 90 top
VE  78.51,43.41 90 bottom

### Tracks (layer width: path | path; a pad name or v marks a point on that pad's centre or on a via)
3.3V  (via drill 0.3, 0.35)  (4 unrouted)
  Top 0.203: v78.99,10.92 80.26,10.92 81.28,11.94 81.28,13.97 82.54,15.23 J5.1
  Top 0.254: R11.2 81.37,42.76 81.03,42.42 81.03,39.88 78.46,37.31 3V3_MEAS.4 | U1.P11 4.73,11.06
  Top 0.559: v70.16,29.97 70.16,10.97 v70.1,10.92 69.85,10.67 69.85,8.53 68.94,7.62 v64.01,7.62 41.66,7.62 v39.19,5.16 | C12.1 62.03,55.77 v62.03,56.59 62.03,57.81 J10.4 | R13.1 4.73,11.06 R12.2 | v75.69,31.75 77.06,33.12 3V3_MEAS.4 3V3_MEAS.2 | v48.26,43.94 49.1,44.78 56.21,44.78 57.15,45.72 v57.15,55.88
  Bottom 0.203: v78.99,10.92 v70.1,10.92 | TP2.1 81.27,17.79 82.61,16.45 J5.1
  Bottom 0.559: v48.26,43.94 48.26,31.16 48.26,31.17 v48.26,29.97 v66.8,29.97 v70.16,29.97 73.91,29.97 v75.69,31.75 | v39.19,5.16 15.6,5.16 15.54,5.21 v15.54,6.4 | v57.15,55.88 61.32,55.88 v62.03,56.59 | I2C_PU.2 v64.01,7.62
  pour Top (isolate 0.305, no thermals): 48.59,30.56 47.42,30.56 47.42,29.73 47.75,29.4 47.75,27.64 48.59,27.64
  pour Top (isolate 0.305, no thermals): 66.9,29.17 67.16,29.42 67.16,30.58 66.19,30.58 66.19,27.58 66.9,27.58
  pour Top (no thermals): 15.58,6.08 15.81,6.08 15.81,6.77 15.18,6.77 15.18,4.53 15.58,4.53
3.3V_EN  (via drill 0.3)
  Top 0.203: v67.72,39.29 67.72,32.54 65.9,30.73 J1.4
  Bottom 0.203: v67.72,39.29 67.79,39.37 73.91,39.37 77.55,43 VE.1
3.3V_EN_VE  (via drill 0.3)
  Top 0.203: U5.5 75.88,45.21 76.96,45.21 77.25,44.92 77.25,43.38 77.54,43.09 R9.1 78.23,42.84 79.58,42.84 D1.C 79.6,43.79 79.76,43.94 v80.52,43.94
  Bottom 0.203: VE.2 80.39,43.81 v80.52,43.94
3.3V_QWIIC  (1 unrouted)
  Top 0.559: C1.1 48.93,60.79 48.74,60.99 J2.2 48.76,64.02 J4.2
  pour Top (no thermals): 49.59,57.98 48.2,57.98 48.2,54.55 49.59,54.55
!BOOT!  (via drill 0.3)
  Top 0.203: S2.4 S2.3 79.22,28.55 v78.08,28.55 | v64.26,23.32 64.14,23.19 64.14,20.91 J1.11 64.15,17.26 64.26,17.15 v64.26,15.11 | v57.12,15.21 56.95,15.38 30.72,15.38 v30.63,15.29 | v24.84,15.27 24.71,15.39 20.07,15.39 18.09,15.39 17.13,14.44 J6.66
  Bottom 0.203: v64.26,23.32 65.91,24.97 74.5,24.97 v78.08,28.55 | v64.26,15.11 57.28,15.11 57.15,15.24 v57.12,15.21 | v24.84,15.27 24.84,15.29 24.87,15.32 30.61,15.32 v30.63,15.29
!CS0!-PROCESSOR  (1 unrouted)
!DFU-FC0!  (via drill 0.3)
  Top 0.203: U1.P12 4.33,8.11 3.73,8.71 R13.2 3.52,9.14 v2.54,9.14 | v31.27,20.4 31.22,20.45 19.36,20.45 18.49,19.58 v18.49,16 | v6.3,15.98 6.3,14.28 7.11,13.46 7.11,9.4 v6.86,9.14 | v31.57,14.8 31.13,14.35 J6.10
  Bottom 0.203: v31.27,20.4 31.57,20.09 v31.57,14.8 | v6.3,15.98 18.47,15.98 v18.49,16 | v2.54,9.14 v6.86,9.14
!DFU-FC1!
  Top 0.203: R12.1 5.77,8.75 5.13,8.11 U1.P10
!RESET!  (via drill 0.3)
  Top 0.203: v67.92,24.11 66.93,24.11 65.4,25.63 65.4,27.1 | J1.6 65.4,27.1 | v79.25,24.13 S1.3 S1.4 | J5.10 84.52,10.15 85.72,11.36 85.72,21.84 85.34,22.23 S1.4 | v64.59,27.1 65.4,27.1 | v44.37,21.23 18.77,21.23 17.8,20.26 17.8,15.7 17.31,15.21 16.63,14.53 J6.68 | J13.1 84.84,21.34 S1.4
  Bottom 0.203: v67.92,24.11 79.22,24.11 v79.25,24.13 | v64.59,27.1 64.39,27.3 45.5,27.3 44.37,26.18 v44.37,21.23
A0-PROCESSOR  (via drill 0.3)
  Top 0.203: J1.34 58.38,28.46 58.38,30.89 57.78,31.49 57.78,35.87 55.98,37.67 v24.38,37.67 | v24.38,28.96 20.32,28.96 17.27,25.91 v17.27,18.03 | J6.38 24.11,12.71 v24.11,14.88
  Bottom 0.203: v24.38,37.67 v24.38,28.96 | v17.27,18.03 23.37,18.03 24.11,17.3 v24.11,14.88
CTS1-PROCESSOR  (via drill 0.3)
  Top 0.203: J1.15 63.15,15.87 v63.2,15.82 | v57.48,15.82 30.3,15.82 29.63,15.15 J6.16
  Bottom 0.203: v57.48,15.82 v63.2,15.82
D0-PROCESSOR  (via drill 0.3)
  Top 0.203: J1.10 64.4,30.29 66.55,32.44 66.55,36.2 65.48,37.26 v65.48,37.29 | v25.43,41.4 v58.45,41.4 | 16.56,18.82 16.56,27.48 19.05,29.97 v25.4,29.97 | v25.45,18.41 26.14,17.73 26.14,11.38 21.64,6.88 21.64,6.27 21.88,6.04 J6.47 | v16.56,18.57 16.56,18.82 | 16.56,18.82
  Bottom 0.203: v58.45,41.4 59.49,41.4 60.07,41.99 60.78,41.99 v65.48,37.29 | v25.43,41.4 25.43,30 v25.4,29.97 | v16.56,18.57 25.3,18.57 v25.45,18.41
D1-PROCESSOR/SD_CARD_!CS!  (1 unrouted)
D+
  Top 0.203: J1.3 66.15,22.64 64.26,24.54 62.34,24.54 60.53,26.34 60.53,33.86 67.23,40.56 67.23,55.13 72.38,60.27 72.38,63.65 72.93,64.2 U3.1 74.01,64.61 75.45,66.05 J3.B6 75.45,68.08 75.69,68.33 76.2,68.33 76.45,68.08 J3.A6
D-  (via drill 0.3)
  Top 0.203: v65.63,23.9 65.41,23.9 64.41,24.89 62.48,24.89 60.86,26.52 60.86,33.68 67.56,40.39 67.56,54.99 72.71,60.14 72.71,62.17 72.84,62.3 U3.3 74.74,62.3 75.17,62.72 75.17,65.26 75.95,66.04 | v64.92,23.04 65.63,22.33 65.63,20.91 J1.5 | J3.B7 76.95,66.54 76.45,66.04 75.95,66.04 | J3.A7 75.95,66.04
  Bottom 0.203: v64.92,23.04 65.63,23.75 v65.63,23.9
G0-PROCESSOR  (via drill 0.3)
  Top 0.203: v20.37,8.1 10.8,8.1 9.43,9.47 9.43,33.39 12.84,36.8 54.68,36.8 56.9,34.57 56.9,34.56 J1.40 | J6.53 20.34,5.17 v20.34,7.01
  Bottom 0.203: v20.37,8.1 20.34,8.08 v20.34,7.01
G1-PROCESSOR  (via drill 0.3)
  Top 0.203: v19.79,8.69 19.66,8.56 11.33,8.56 9.93,9.96 9.93,33.26 12.97,36.3 53.96,36.3 56.36,33.9 56.36,28.48 J1.42 | v19.81,6.53 19.88,6.46 J6.55
  Bottom 0.203: v19.81,6.53 19.79,6.55 v19.79,8.69
G2-PROCESSOR  (via drill 0.3)
  Top 0.203: v19.07,9.07 19,8.99 11.81,8.99 10.33,10.47 10.33,32.88 13.2,35.75 53.22,35.75 55.9,33.06 J1.44 | v19.1,6.53 19.1,6.45 19.38,6.17 J6.57
  Bottom 0.203: v19.1,6.53 19.1,9.04 v19.07,9.07
G3-PROCESSOR  (via drill 0.3)
  Top 0.203: J1.46 55.4,32.68 52.89,35.2 13.26,35.2 10.77,32.71 10.77,10.74 11.99,9.53 v12.12,9.53 | v14.88,7.09 17.8,7.09 18.88,6.01 J6.59
  Bottom 0.203: v12.12,9.53 12.12,7.44 12.47,7.09 v14.88,7.09
G4-PROCESSOR  (1 unrouted)
GND  (via drill 0.3)  (196 unrouted)
  Top 0.203: J6.39 v23.88,6.93
  Top 0.254: 25.13,11.18 J6.34 25.13,13.93 arc-45 25.15,13.97 | 25.13,11.18 24.63,11.18 J6.36 24.63,13.95 arc-45 24.64,13.97 25.15,13.97 | 25.13,11.18 25.38,11.18 25.63,11.43 J6.32 25.63,13.97 25.15,13.97 | J6.2 33.13,12.95 | 33.13,12.95 33.13,13.97 32.03,13.97 31.63,13.57 J6.8 | v34.09,12.98 34.06,12.95 33.13,12.95 | J6.1 33.38,4.29 33.66,4.01 34.29,4.01 v34.37,4.09 | J1.36 57.9,29.73 57.4,30.23 57.4,30.74 v57.42,30.76 | J6.39 23.88,3.56 | 23.88,3.56 22.35,3.56 22.35,5.11 J6.45 | J6.33 25.38,4.27 24.67,3.56 23.88,3.56
  other vias: 77.37,40.87 78.89,17.12 72.39,15.24 80.77,54.61 77.11,10.39 63.78,52.93 64.54,55.85 64.41,59.54 63.42,13.36 65.05,15.72 66.98,10.82 55.04,23.04 50.39,22.61 61.77,23.77 66.73,22.68 76.83,29.87 54.1,57 11.56,6.15 55.55,18.69 63.92,23.97 59.3,36.22 64.6,34.41 66.33,37.61 51.04,43.58 77.37,39.45 66.6,12.85 72.42,7.37 80.06,3.07 51.74,26.29 42.65,14.85 42.72,13.16 44.96,22.91 55.8,13.36 49.09,25.32 51.57,23.19 66.75,19.56 65.35,19.56 56.41,14.87 63.54,40.28 53.12,33.17 4.75,3.56 9.19,8.59 21.49,7.52 57.96,17.2 79.43,27.05 19.05,16.74 25.36,14.81 49.08,22.09 14.81,6.38 57.43,12.14 29.24,7.44 25.48,6.45 22.3,6.4 1.45,8.05 44.15,20.22 45.77,20.6 18.77,22.61 15.04,22.94 13.46,26.72 15.67,28.3 11.48,31.01 6.6,31.52 1.85,20.68 5.92,20.4 6.68,16.79 16.13,18.03 2.21,6.05 6.73,5.89 3.07,7.8 6.86,8.26 6.05,3.51 14.86,3.78 30.86,19.68 24.94,17.88 30.15,14.78 32.36,14.86 29.9,9.32 29.31,3.2 30.86,2.46 20.68,3.35 18.59,7.04 38.02,8.13 38.48,5.89 44.7,12.78 48.23,13.11 48.34,14.8 25.17,29.16 23.55,37.57 24.69,41.83 66.05,26.79 64.71,26.26 46.79,30.51 11.48,25.15 11.4,20.47 11.4,17.25 11.48,13.89 6.25,25.17 6.17,28.52 49.83,31.22 50.93,31.83 69.01,60.05 52.98,59.61 52.04,67.77 69.75,67.92 20.9,14.83 68.12,15.29 69.16,13.21 73.05,43.92 73.08,26.72 84.99,13.31 7.67,1.96 49.78,62.48 49.78,69.85 59.97,9.16 61.01,8.41 59.33,10.05 26.85,18.14 73.03,66.29 79.43,65.51 83.49,60.93 83.49,63.47 76.61,43.92 74.52,53.37 76.96,46.74 76.96,48.51 50.04,54.08 51.84,56.95 36.83,66.04 9.27,3.61 46.62,41.96 72.92,63.22 27.94,66.04 27.94,57.15 36.83,57.15 19.05,66.04 19.05,57.15 10.16,57.15 10.16,66.04 48.51,49.15 48.51,45.72
  pour Top (rank 4): 86.46,73.76 -0.1,73.76 -0.1,-0.1 86.46,-0.1
  pour Bottom (rank 4): 86.46,73.76 -0.1,73.76 -0.1,-0.1 86.46,-0.1
HOST_D+
  Top 0.203: J6.35 24.88,6.88 27.72,9.72 27.72,15.72 28.96,16.95 56.77,16.95 57.57,17.75 57.57,19.13 58.15,19.71 J1.35
HOST_D-
  Top 0.203: J6.37 24.38,6.85 27.39,9.86 27.39,15.91 28.77,17.29 56.46,17.29 57.24,18.07 57.24,19.27 57.65,19.68 J1.37
I2C_!INT!  (1 unrouted)
  Top 0.203: J6.23 27.94,5.08
I2C_SCL  (via drill 0.3)
  Top 0.203: v61.72,39.17 58.88,42.01 47.35,42.01 46.84,42.52 46.84,63.9 J2.4 46.74,68.56 J4.4 | v61.98,26.24 62.92,26.24 63.4,26.73 J1.14 63.4,30.99 65.25,32.84 v65.25,35.64 | v60.78,25.04 60.78,24.89 60.43,24.54 60.43,10.89 60.68,10.64 | J6.21 28.38,6 28.78,6.4 v28.78,6.81 | v38.3,7.39 38.3,7.42 40.08,9.2 59.28,9.2 60.68,10.59 60.68,10.64 | 60.68,10.64 60.81,10.5 R15.1
  Bottom 0.203: v61.72,39.17 v65.25,35.64 | v61.98,26.24 61.98,26.19 60.83,25.04 v60.78,25.04 | v38.3,7.39 37.82,6.91 28.88,6.91 v28.78,6.81
I2C_SCL1-PROCESSOR/QWIIC_EN  (via drill 0.3)
  Top 0.203: U4.3 50.93,52.86 50.93,52.96 51.56,53.59 51.56,54.61 51.82,54.86 52.49,54.86 R4.1 53.2,54.95 53.7,54.46 v53.7,48.34 | J1.53 53.65,22.29 v53.62,22.32 | v49.28,26.67 48.58,26.67 48,27.24 46.39,27.24 46.1,27.53 v46.1,30.45
  Bottom 0.203: v53.62,22.32 50.9,25.04 50.9,26.26 50.42,26.75 49.28,26.75 v49.28,26.67 | v46.1,30.45 46.1,46.38 46.53,46.81 52.17,46.81 v53.7,48.34
I2C_SDA  (via drill 0.3)
  Top 0.203: v62.51,39.14 59.03,42.62 47.99,42.62 47.74,42.88 J2.3 47.76,64.02 J4.3 | v62.48,25.65 63.3,25.65 63.9,26.26 J1.12 63.9,30.62 65.91,32.63 65.91,35.84 65.2,36.55 v65.18,36.55 | v61.32,24.41 60.76,23.85 60.76,11.53 61.01,11.28 65.11,11.28 65.28,11.11 R14.1 64.43,9.65 60.96,9.65 60.48,9.17 60.48,8.71 60.26,8.5 40.88,8.5 v38.89,6.5 | v29.39,6.38 28.88,5.87 J6.19
  Bottom 0.203: v62.51,39.14 65.1,36.55 v65.18,36.55 | v29.39,6.38 29.41,6.4 38.79,6.4 v38.89,6.5 | v62.48,25.65 62.48,25.6 61.32,24.43 v61.32,24.41
N$1  (4 unrouted)
  pour Top (isolate 0.305, no thermals): 75.27,41.82 74,41.82 74,42.96 73.37,42.96 73.37,36.21 75.27,36.21
N$2  (via drill 0.3)
  Top 0.203: D8.C v83.82,47.65
  Bottom 0.203: 5V_LED.2 v83.82,47.65
N$3
  Top 0.203: D3.A 83.43,41.03 83.46,41.06 R11.1
N$4
  Top 0.203: J3.B5 74.45,66.68 72.94,65.16 R2.2
N$5  (via drill 0.3)
  Top 0.203: v77.44,66.27 77.42,66.29 77.45,66.31 J3.A5 | v80.97,65.23 81.93,65.23 R1.2
  Bottom 0.203: v77.44,66.27 79.98,66.27 80.97,65.28 v80.97,65.23
N$6
  Top 0.203: R3.2 75.78,17.15 76.23,16.7 U2.5
N$10  (via drill 0.3)
  Top 0.203: D3.C v83.82,43.74
  Bottom 0.203: 3V3_LED.2 v83.82,43.74
N$11  (via drill 0.3)
  Top 0.203: R14.2 66.38,8.8 v66.55,8.64
  Bottom 0.203: I2C_PU.3 65.02,9.63 65.02,8.89 65.28,8.64 v66.55,8.64
N$12
  Top 0.203: R8.1 82.32,44.84 D8.A
N$13  (via drill 0.3)
  Top 0.203: R15.2 62.65,9.14 v61.27,9.14
  Bottom 0.203: v61.27,9.14 61.77,9.65 I2C_PU.1
N$14
  Top 0.203: R5.2 82.32,38.98 D4.C
N$15  (via drill 0.3)
  Top 0.203: R5.1 82.3,32 80.06,29.77 v78.05,29.77 | v72.64,26.06 72.64,16.41 72.86,16.19 U2.1
  Bottom 0.203: v78.05,29.77 74.35,26.06 v72.64,26.06
PROCESSOR_CAN-RX
  Top 0.203: J1.41 56.65,18.33 56.16,17.84 28.35,17.84 26.89,16.38 26.89,10.69 23.37,7.17 23.37,7.16 22.81,6.6 22.81,6.12 22.88,6.05 J6.43
PROCESSOR_CAN-TX  (via drill 0.3)
  Top 0.203: v22.69,7.21 22.89,7.21 26.54,10.87 26.54,16.61 28.12,18.19 55.78,18.19 56.15,18.56 J1.43 | v23.37,6.38 23.38,6.36 J6.41
  Bottom 0.203: v22.69,7.21 23.37,6.54 v23.37,6.38
PWM0-PROCESSOR
  Top 0.203: J1.32 58.9,31.07 58.4,31.57 58.4,36.21 56.26,38.35 11.07,38.35 8.36,35.64 8.36,8.48 9.25,7.59 20.6,7.59 20.88,7.31 J6.51
PWR_EN0  (1 unrouted)
RTS1-PROCESSOR  (via drill 0.3)
  Top 0.203: J1.13 63.65,16.43 v63.7,16.38 | v56.92,16.38 29.84,16.38 29.13,15.67 J6.18
  Bottom 0.203: v56.92,16.38 v63.7,16.38
RX1-DFU_TX-FC0-PLEX
  Top 0.203: J6.4 32.63,10.66 31.86,9.89 29.18,9.89 26.32,7.03 26.32,4.13 24.7,2.52 7.87,2.52 7.44,2.95 7.44,6.17 6.55,7.07 U1.P9
RX1-PROCESSOR  (via drill 0.3)
  Top 0.203: v56.7,13.33 56.6,13.33 55.53,12.26 37.26,12.26 33.67,8.67 29.17,8.67 26.98,6.48 26.98,3.63 25.43,2.08 5.92,2.08 5.26,2.74 5.26,5.32 5.13,5.44 U1.P6 | v62.16,13.4 v62.15,13.41 J1.19
  Bottom 0.203: v62.16,13.4 56.77,13.4 v56.7,13.33
RX1-PROCESSOR-PLEX  (via drill 0.3)
  Top 0.203: J6.13 30.38,2.95 28.37,0.94 3.25,0.94 2.67,1.52 2.67,5.79 v3.02,6.15 | v5.99,5.86 5.99,5.98 5.71,6.26 U1.P7
  Bottom 0.203: v5.99,5.86 5.71,6.15 v3.02,6.15
SHLD  (4 unrouted)
  pour Bottom (isolate 0.305, no thermals): 80.37,72.8 71.53,72.8 71.53,67.21 80.37,67.21
  pour Top (isolate 0.305, no thermals): 80.62,72.8 71.53,72.8 71.53,67.21 80.62,67.21
SPI_PROCESSOR_SCK  (via drill 0.3)
  Top 0.203: J1.57 52.65,22.07 53.9,23.32 | 53.9,23.32 54.46,23.88 58.29,23.88 59.05,23.11 59.05,12.32 57.99,11.25 37.92,11.25 35.74,9.07 35.74,4.19 35.1,3.56 33.25,3.56 32.88,3.92 J6.3 | v52.58,24.64 53.59,25.65 58.67,25.65 59.69,26.67 59.69,34.7 65.91,40.92 65.91,52.96 63.11,55.76 J10.5 | v54.36,22.86 53.9,23.32
  Bottom 0.203: v52.58,24.64 v54.36,22.86
SPI_PROCESSOR_SDI
  Top 0.203: J1.61 51.65,21.8 51.6,21.85 51.6,22.43 54.3,25.13 59.17,25.13 59.56,25.53 | 59.56,25.53 60.1,26.06 60.1,34.27 66.53,40.7 66.53,55.02 65.31,56.24 J10.7 | 59.56,25.53 60.05,25.04 60.05,11.53 58.45,9.93 38.45,9.93 37.24,8.72 37.24,3.35 36.17,2.29 32.77,2.29 31.88,3.17 J6.7
SPI_PROCESSOR_SDO  (via drill 0.3)
  Top 0.203: J1.59 52.13,20.91 v52.13,22.1 52.13,22.25 54.51,24.63 58.88,24.63 59.55,23.96 59.55,11.71 58.39,10.55 37.94,10.55 36.55,9.16 36.55,3.79 35.66,2.9 32.99,2.9 32.38,3.51 J6.5 | v51.05,22.1 51.05,24.38 52.77,26.1 58.23,26.1 59.31,27.18 59.31,35.15 65.23,41.07 65.23,49.43 60.91,53.75 J10.3
  Bottom 0.203: v51.05,22.1 v52.13,22.1
SWDCK  (via drill 0.3)
  Top 0.203: J1.21 61.65,12.77 62.23,12.19 v67.31,12.19 | v79.5,12.45 80.26,13.21 80.26,16.84 80.95,17.53 84.28,17.53 84.84,16.97 84.84,14.35 84.45,13.96 J5.4
  Bottom 0.203: v67.31,12.19 79.25,12.19 v79.5,12.45
SWDIO  (via drill 0.3)
  Top 0.203: J1.23 61.15,12.25 61.72,11.68 v66.67,11.68 | v79.76,11.68 80.77,12.7 80.77,16.51 81.28,17.02 83.57,17.02 83.88,16.7 J5.2
  Bottom 0.203: J5.2 83.88,17.77 TP1.1 | v66.67,11.68 v79.76,11.68
TX1-DFU_RX-FC0-PLEX  (via drill 0.3)
  Top 0.203: v6.43,7.67 6.93,7.67 8.05,6.55 8.05,3.31 8.52,2.85 24.56,2.85 25.98,4.27 25.98,7.19 29.06,10.26 31.75,10.26 32.13,10.64 J6.6 | U1.P1 3.6,7.07 v3.45,7.21
  Bottom 0.203: v3.45,7.21 3.56,7.11 5.87,7.11 v6.43,7.67
TX1-PROCESSOR  (via drill 0.3)
  Top 0.203: v62.66,12.83 62.66,12.93 62.68,12.96 62.68,20.86 J1.17 | v56.66,12.61 55.98,11.93 37.4,11.93 33.81,8.34 29.31,8.34 27.3,6.34 27.3,3.47 25.56,1.73 5.04,1.73 4.24,2.53 4.24,5.41 4.33,5.5 U1.P4
  Bottom 0.203: v62.66,12.83 62.53,12.83 62.52,12.83 56.88,12.83 v56.66,12.61
TX1-PROCESSOR-PLEX
  Top 0.203: J6.15 29.87,5.13 29.87,2.9 28.23,1.27 4.17,1.27 3.5,1.93 3.5,5.91 3.86,6.26 U1.P3
V_BATT  (via drill 0.3)
  Top 0.559: Q1.3 72.64,56.13 70.46,53.95 70.46,31.39 71.63,30.23 71.63,14.86 72.2,14.29 U2.3 73.63,13.15 C4.1 74.08,11.43 75.18,10.33 75.18,6.86 75.95,6.1 75.95,5.08 | 75.95,5.08 75.95,4.83 75.2,4.08 J8.2 | 75.95,5.08 v77.47,5.08
  Bottom 0.559: v77.47,5.08 TP3.1
V_USB  (via drill 0.3)  (2 unrouted)
  Top 0.203: 78.33,64.21 78.33,63.45 78.13,63.25 U3.5
  Top 0.254: J3.VBUS2 73.75,67.55 74.88,68.68 77.52,68.68 78.65,67.55 J3.VBUS1
  Top 0.559: F2.1 79.25,63.99 78.65,64.58 J3.VBUS1
  Bottom 0.559: BYP.1 79.45,62.92 v79.32,63.04
  pour Top (isolate 0.305, no thermals): 79.82,63.51 80.84,63.51 80.84,64.86 77.66,64.86 77.66,63.51 78.8,63.51 78.8,62.83 79.82,62.83
VCC  (via drill 0.3)  (9 unrouted)
  Top 0.203: D4.A 82.94,38.1 81.28,38.1 80.77,37.59 80.77,34.8 79.76,33.78 v78.74,33.78 | v52.58,50.8 R4.2
  Top 0.559: U2.4 76.9,14.29 77.52,14.91 77.52,27.74 72.26,32.99 v72.26,33.78 72.01,34.04 v72.01,50.8 72.01,52.96 74.05,55 D5.C
  Bottom 0.203: v78.74,33.78 v72.26,33.78
  Bottom 0.559: v15.37,14.22 15.49,14.1 77.72,14.1 v77.85,14.22 | v72.01,50.8 v52.58,50.8 50.8,50.8 50.29,50.29 v49.02,50.29
  pour Top (isolate 0.305, no thermals): 79.67,15.07 77.65,15.07 77.14,14.57 75.48,14.57 75.48,13.8 77.29,13.8 77.55,13.55 79.67,13.55
  pour Top (no thermals): 15.3,13.65 15.43,13.65 15.43,11.87 15.81,11.87 15.81,13.65 16.07,13.65 16.07,14.95 14.77,14.95 14.77,13.65 14.92,13.65 14.92,11.87 15.3,11.87
  pour Top (isolate 0.305, no thermals): 77.79,54.04 79.82,54.04 79.82,55.69 75.63,55.69 75.63,49.72 77.79,49.72
  pour Top (no thermals): 49.59,53.4 48.2,53.4 48.2,49.97 49.59,49.97
VCC_MEAS  (4 unrouted)
  Top 0.203: R9.2 77.98,45.72 77.69,46.01 74.88,46.01 74.15,46.74 C5.1
  pour Top (isolate 0.305, no thermals): 73.98,45.91 74.99,45.91 74.99,51.63 73.09,51.63 73.09,44.89 73.98,44.89
VIN  (via drill 0.3)  (1 unrouted)
  Top 0.203: R6.2 80.91,61.24 F2.2 | 75.91,19.3 R10.2 75.78,18.73 75.59,18.54 v73.15,18.54 | Q1.1 81.85,57.08 82.55,56.39 82.55,54.36 80.52,52.32 80.52,47.24 81.19,46.57 R8.2
  Top 0.254: J1.9 64.65,19.29 65.28,18.67
  Top 0.559: 65.28,18.67 67.87,18.67 v68.42,19.21 69.01,19.81 69.01,54.65 73.66,59.3 D5.A | D5.A 76.71,60.96 76.99,61.24 F2.2 | Q1.1 79.26,58.66 78.62,59.3 D5.A
  Bottom 0.203: v73.15,18.54 69.09,18.54 v68.42,19.21
  Bottom 0.559: v79.25,62.23 79.38,62.1 BYP.2 80.67,62.13 TP4.1
  pour Top (isolate 0.305, no thermals): 80.81,61.61 79.92,61.61 79.92,62.52 78.7,62.52 78.7,61.61 77.69,61.61 77.69,60.52 80.81,60.52
VIN/3  (via drill 0.3)
  Top 0.203: J1.49 54.65,21.84 54.96,22.15 v55.07,22.15 | R10.1 R7.2 74.08,21.93 v73.91,22.1
  Bottom 0.203: v73.91,22.1 55.12,22.1 v55.07,22.15

### Text on the board
Bottom: v12
tPlace: - | +
Measures: Units in Inches
tDocu: Elias Santistevan